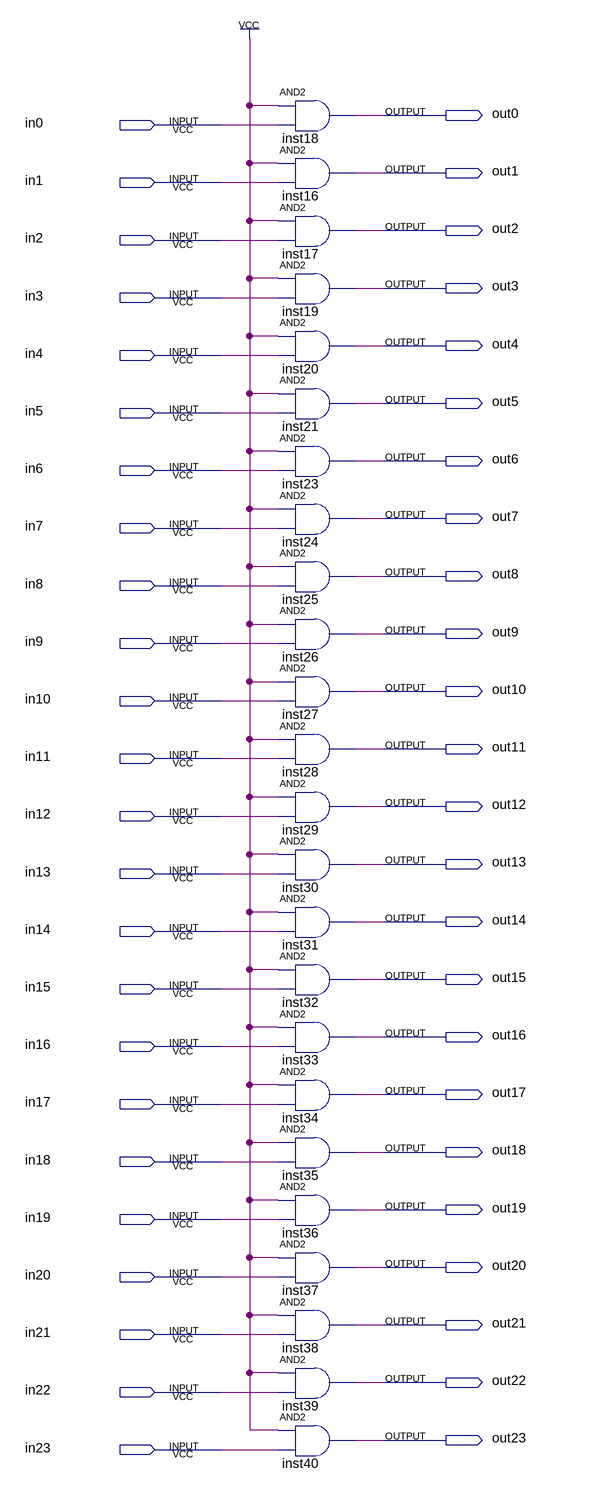
[diagram p0: schematic sheet]
// Quartus schematic theAnd.bdf as structural Verilog: 24 symbols, 48 pins
module theAnd (
  input  in0,
  input  in1,
  input  in2,
  input  in3,
  input  in4,
  input  in5,
  input  in6,
  input  in7,
  input  in8,
  input  in9,
  input  in10,
  input  in11,
  input  in12,
  input  in13,
  input  in14,
  input  in15,
  input  in16,
  input  in17,
  input  in18,
  input  in19,
  input  in20,
  input  in21,
  input  in22,
  input  in23,
  output out0,
  output out1,
  output out2,
  output out3,
  output out4,
  output out5,
  output out6,
  output out7,
  output out8,
  output out9,
  output out10,
  output out11,
  output out12,
  output out13,
  output out14,
  output out15,
  output out16,
  output out17,
  output out18,
  output out19,
  output out20,
  output out21,
  output out22,
  output out23
);

  and inst18 (out0, 1'b1, in0);
  and inst16 (out1, 1'b1, in1);
  and inst17 (out2, 1'b1, in2);
  and inst19 (out3, 1'b1, in3);
  and inst20 (out4, 1'b1, in4);
  and inst21 (out5, 1'b1, in5);
  and inst23 (out6, 1'b1, in6);
  and inst24 (out7, 1'b1, in7);
  and inst25 (out8, 1'b1, in8);
  and inst26 (out9, 1'b1, in9);
  and inst27 (out10, 1'b1, in10);
  and inst28 (out11, 1'b1, in11);
  and inst29 (out12, 1'b1, in12);
  and inst30 (out13, 1'b1, in13);
  and inst31 (out14, 1'b1, in14);
  and inst32 (out15, 1'b1, in15);
  and inst33 (out16, 1'b1, in16);
  and inst34 (out17, 1'b1, in17);
  and inst35 (out18, 1'b1, in18);
  and inst36 (out19, 1'b1, in19);
  and inst37 (out20, 1'b1, in20);
  and inst38 (out21, 1'b1, in21);
  and inst39 (out22, 1'b1, in22);
  and inst40 (out23, 1'b1, in23);
endmodule
